# Altium project ESD_Project.PrjPcb
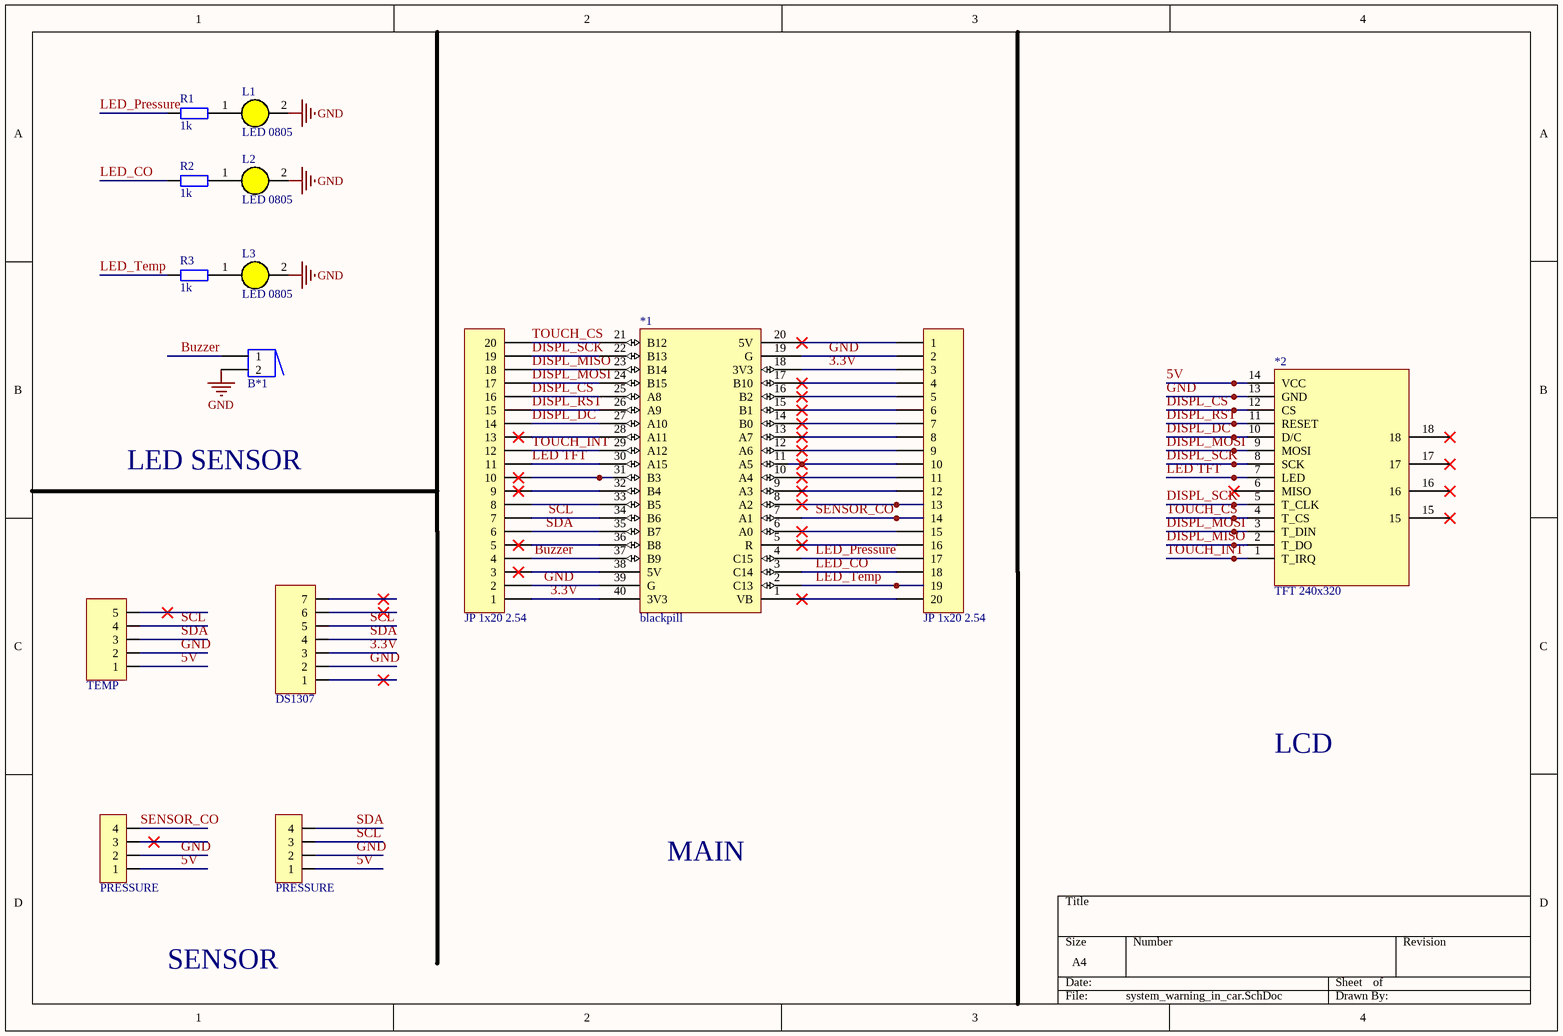
[diagram p0: system_warning_in_car.SchDoc]
3 sheets, 38 parts. Net scope: global (net labels, ports and power ports of the same name join across sheets).
Board file: system_warning_in_car.PcbDoc
Sheets:
  system_warning_in_car.SchDoc
  Power Diagram.SchDoc
  Power Suply.SchDoc

## Sheet system_warning_in_car.SchDoc
size A4; SheetNumber: 1; SheetTotal: 4

### Parts
*1  blackpill  [Blackpill]
*2  TFT 240x320  [TFT ILI]
B*1  (no value)  [BUZZER SMD]
JP1  JP 1x20 2.54  [JP 1x20 CT]
JP2  JP 1x20 2.54  [JP 1x20 CT]
JP3  DS1307  [JP 1x7 CT]
JP4  TEMP  [JP 1x5 CT]
JP5  PRESSURE  [JP 1x4 CT]
JP6  PRESSURE  [JP 1x4 CT]
L1  LED 0805  [LED-0805-Yellow]
L2  LED 0805  [LED-0805-Yellow]
L3  LED 0805  [LED-0805-Yellow]
R1  1k  [tro smd 0805]
R2  1k  [tro smd 0805]
R3  1k  [tro smd 0805]

### Nets
3.3V: *1.18(3V3) *1.40(3V3) JP1.1 JP2.3 JP3.3
5V: *2.14(VCC) JP4.1 JP5.1 JP6.1
GND: *1.19(G) *1.39(G) *2.13(GND) B*1.2 JP1.2 JP2.2 JP3.2 JP4.2 JP5.2 JP6.2 L1.2(K) L2.2(K) L3.2(K)
Buzzer: *1.37(B9) B*1.1 JP1.4
DISPL_CS: *1.25(A8) *2.12(CS) JP1.16
DISPL_DC: *1.27(A10) *2.10(D/C) JP1.14
DISPL_MISO: *1.23(B14) *2.2(T_DO) JP1.18
DISPL_MOSI: *1.24(B15) *2.3(T_DIN) *2.9(MOSI) JP1.17
DISPL_RST: *1.26(A9) *2.11(RESET) JP1.15
DISPL_SCK: *1.22(B13) *2.5(T_CLK) *2.8(SCK) JP1.19
LED TFT: *1.30(A15) *2.7(LED) JP1.11
LED_CO: *1.3(C14) JP2.18 R2.2
LED_Pressure: *1.4(C15) JP2.17 R1.2
LED_Temp: *1.2(C13) JP2.19 R3.2
SCL: *1.34(B6) JP1.7 JP3.5 JP4.4 JP6.3
SDA: *1.35(B7) JP1.6 JP3.4 JP4.3 JP6.4
SENSOR_CO: *1.7(A1) JP2.14 JP5.4
TOUCH_CS: *1.21(B12) *2.4(T_CS) JP1.20
TOUCH_INT: *1.29(A12) *2.1(T_IRQ) JP1.12
Net*1_1: *1.1(VB) JP2.20
Net*1_5: *1.5(R) JP2.16
Net*1_6: *1.6(A0) JP2.15
Net*1_8: *1.8(A2) JP2.13
Net*1_9: *1.9(A3) JP2.12
Net*1_10: *1.10(A4) JP2.11
Net*1_11: *1.11(A5) JP2.10
Net*1_12: *1.12(A6) JP2.9
Net*1_13: *1.13(A7) JP2.8
Net*1_14: *1.14(B0) JP2.7
Net*1_15: *1.15(B1) JP2.6
Net*1_16: *1.16(B2) JP2.5
Net*1_17: *1.17(B10) JP2.4
Net*1_20: *1.20(5V) JP2.1
Net*1_28: *1.28(A11) JP1.13
Net*1_31: *1.31(B3) JP1.10
Net*1_32: *1.32(B4) JP1.9
Net*1_33: *1.33(B5) JP1.8
Net*1_36: *1.36(B8) JP1.5
Net*1_38: *1.38(5V) JP1.3
NetL1_1: L1.1(A) R1.1
NetL2_1: L2.1(A) R2.1
NetL3_1: L3.1(A) R3.1

Not connected (* = marked no-connect by the designer): *2 6(MISO)* 15* 16* 17* 18*; JP3 1* 6* 7*; JP4 5*; JP5 3*

### Notes on the sheet
- LED SENSOR
- LCD
- MAIN
- SENSOR

### Library data of the parts
B*1 = Buzzer
JP1 JP2 = JP 1x20 2.54 Cai Thang: Cắm; Ten_Linh_Kien: Jump Đơn Cái 2.54MM 1x20P Thẳng; Don_Vi: Con; Ma_Hang: MH004006; Ghi_Chu: *; Kieu_Chan: *; Chung_Loai: Cắm
JP3 = JP 1x7 2.54 Cai Thang: Cắm; Ten_Linh_Kien: Jump Đơn Cái 2.54MM 1x20P Thẳng; Don_Vi: Con; Ma_Hang: MH004006; Ghi_Chu: *; Kieu_Chan: *; Chung_Loai: Cắm
JP4 = JP 1x5 2.54 Cai Thang: Cắm; Ten_Linh_Kien: Jump Đơn Cái 2.54MM 1x20P Thẳng; Don_Vi: Con; Ma_Hang: MH004006; Ghi_Chu: *; Kieu_Chan: *; Chung_Loai: Cắm
JP5 JP6 = JP 1x4 2.54 Cai Thang: Cắm; Ten_Linh_Kien: Jump Đơn Cái 2.54MM 1x20P Thẳng; Don_Vi: Con; Ma_Hang: MH004006; Ghi_Chu: *; Kieu_Chan: *; Chung_Loai: Cắm
L1-L3 = LED 0805 Vang: Dán; Don_Vi: Con; Ma_Hang: MH002329; Ten_Linh_Kien: LED 0805 Màu Vàng ( Yellow); Ghi_Chu: *; Kieu_Chan: *; Chung_Loai: Dán
R1-R3 = Tro 0805 1% 1k: Dán; Don_Vi: Con; So_Chan: 2; Ten_Linh_Kien: Trở 0805 1% 1k; Ma_Hang: MH005468; Chung_Loai: Dán; Kieu_Chan: *

## Sheet Power Diagram.SchDoc
size A4; SheetNumber: 3; SheetTotal: 4
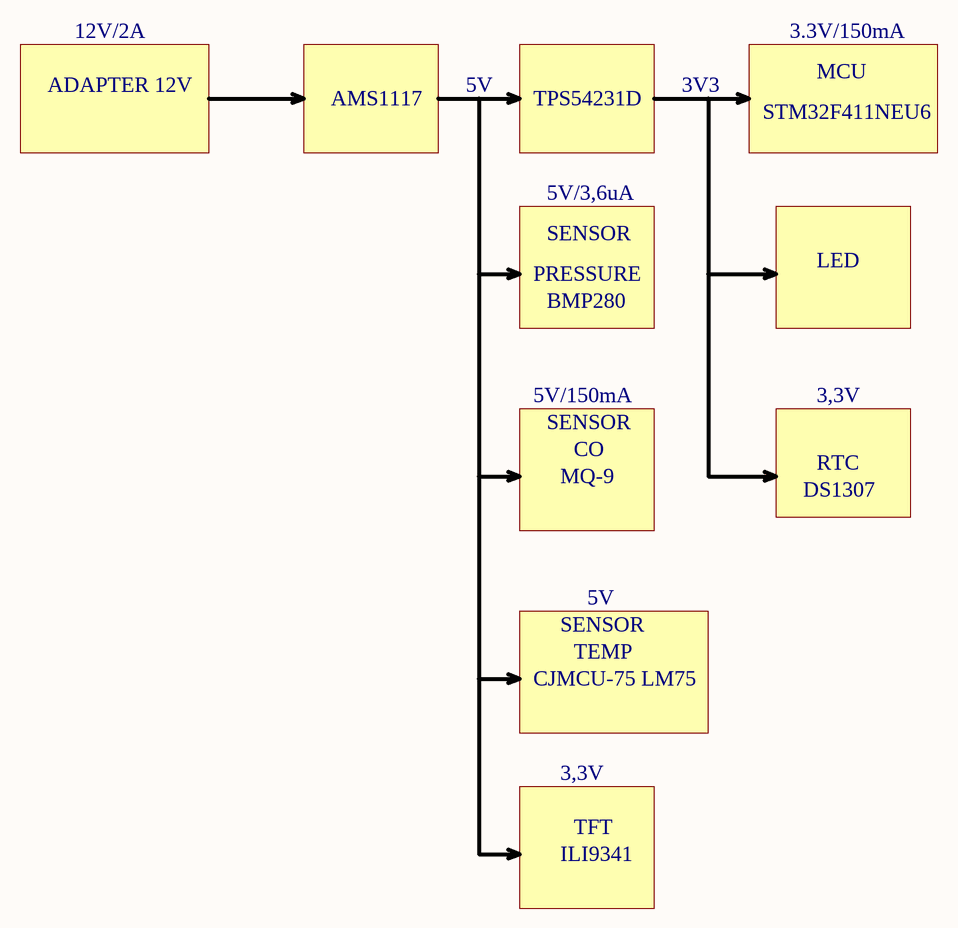
[diagram p1: Power Diagram.SchDoc]

### Notes on the sheet
- ADAPTER 12V
- 12V/2A
- 5V
- 3V3
- 3.3V/150mA
- MCU
- AMS1117
- TPS54231D
- STM32F411NEU6
- 5V/3,6uA
- PRESSURE
- SENSOR
- LED
- BMP280
- 5V/150mA
- 3,3V
- MQ-9
- CO
- DS1307
- RTC
- CJMCU-75 LM75
- TEMP
- TFT
- ILI9341

## Sheet Power Suply.SchDoc
size A4; SheetNumber: 4; SheetTotal: 4
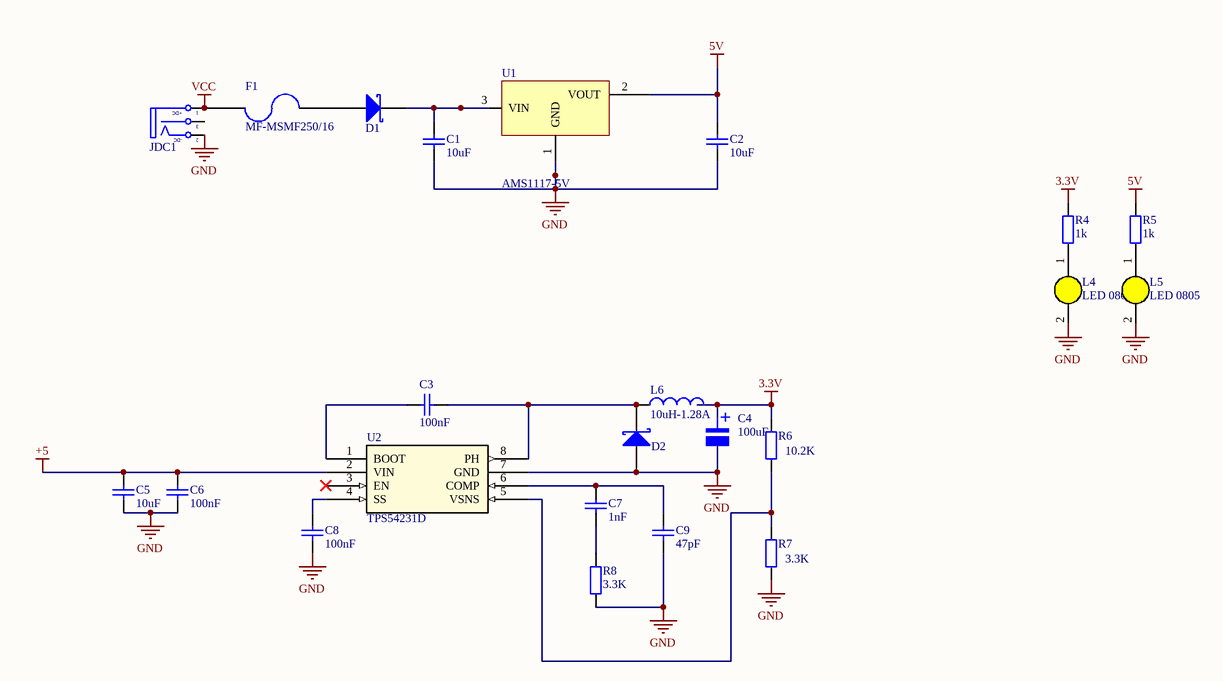
[diagram p2: Power Suply.SchDoc]

### Parts
C1  10uF  [tu 0805]
C2  10uF  [tu 0805]
C3  100nF  [tu 0805]
C4  100uF  [tu nhom 6.3 (d)]
C5  10uF  [tu 0805]
C6  100nF  [tu 0805]
C7  1nF  [tu 0805]
C8  100nF  [tu 0805]
C9  47pF  [tu 0805]
D1  D Schottky  [SS34]  (value not drawn)
D2  D Schottky  [SS34]  (value not drawn)
F1  MF-MSMF250/16  [MF-MSMF250/16]
JDC1  Jack DC  [DC-IN]  (value not drawn)
L4  LED 0805  [LED-0805-Yellow]
L5  LED 0805  [LED-0805-Yellow]
L6  value 10uH-1.28A  [I0805]  (hidden comment: Inductor)
R4  1k  [tro smd 0805]
R5  1k  [tro smd 0805]
R6  10.2K  [tro smd 0805]
R7  3.3K  [tro smd 0805]
R8  3.3K  [tro smd 0805]
U1  AMS1117-5V  [SOT230P700X180-4N]
U2  TPS54231D  [SOIC8_50_328_25X90_SMT]

### Nets
3.3V: C4.1 L6.2 R4.2 R6.2
5V: C2.1 R5.2 U1.2(VOUT)
+5: C5.2 C6.2 U2.2(VIN)
GND: C1.2 C2.2 C4.2 C5.1 C6.1 C8.1 C9.1 D2.1(A) JDC1.2(TN) L4.2(K) L5.2(K) R7.1 R8.1 U1.1(GND) U2.7(GND)
VCC: F1.1 JDC1.1(T)
NetC1_1: C1.1 D1.2(K) U1.3(VIN)
NetC3_1: C3.1 U2.1(BOOT)
NetC3_2: C3.2 D2.2(K) L6.1 U2.8(PH)
NetC7_1: C7.1 R8.2
NetC7_2: C7.2 C9.2 U2.6(COMP)
NetC8_2: C8.2 U2.4(SS)
NetD1_1: D1.1(A) F1.2
NetL4_1: L4.1(A) R4.1
NetL5_1: L5.1(A) R5.1
NetR6_1: R6.1 R7.2 U2.5(VSNS)

Not connected (* = marked no-connect by the designer): JDC1 3(S); U2 3(EN)*

### Notes on the sheet
- (in symbol Jack DC) +DC; -DC
- (in symbol Tu Nhom 100uF 16V) +

### Library data of the parts
C1 C2 = Tu 0805 101 50V 20%: Dán; Don_Vi: Con; So_Chan: 2; Ten_Linh_Kien: Tụ 0805 101-0.1nF 50V 20%; Ma_Hang: MH002806; Chung_Loai: Dán; Kieu_Chan: *
C3 C5-C9 = Tu 0805 106 16V 10%: Dán; Ten_Linh_Kien: Tụ 0805 106-10uF 10% 16V; So_Chan: 2; Don_Vi: Con; Ma_Hang: MH004553; Chung_Loai: Dán; Kieu_Chan: *
C4 = Tu Nhom 100uF 16V: Dán; Don_Vi: Con; So_Chan: 2; Ten_Linh_Kien: Tụ Nhôm 100uF 16V 6.3x5.4MM; Ma_Hang: MH002219; Chung_Loai: Dán; Kieu_Chan: *
D1 D2 = D Schottky: Schottky Diode; Published: 8-Jun-2000; LatestRevisionDate: 17-Jul-2002; LatestRevisionNote: Re-released for DXP Platform.; PackageReference: SMB; Publisher: Altium Limited; PackageDescription: DO-214-AA/SMB; 2 C-Bend Leads; Body 5.3 x 3.6 mm, inc. leads (LxW); Code_JEDEC: DO-214-AA
JDC1 = Jack DC: Jack DC input; Value: Jac DC
L4 L5 = LED 0805 Vang: as L1 on sheet system_warning_in_car; Ghi_Chu: *; Kieu_Chan: *; Chung_Loai: Dán
R4 R5 = Tro 0805 1% 1k: as R1 on sheet system_warning_in_car; Chung_Loai: Dán; Kieu_Chan: *
R6-R8 = Tro 0805 1% 5.1k: Dán; Don_Vi: Con; So_Chan: 2; Ten_Linh_Kien: Trở 0805 1% 5.1k; Ma_Hang: MH008812; Chung_Loai: Dán; Kieu_Chan: *
U2 = IC_TPS54360DDAR: Buck, Split Rail Switching Regulator IC Positive Adjustable 0.8V 1 Output 3.5A 8-PowerSOIC (0.154", 3.90mm Width); Manufacturer: Texas Instruments; Alternate Part Number-1: NA; Manufacturer Part Number: TPS54360DDAR; Case/Package: SOIC8; Supplier-1: LCSC; Supplier Part Number-1: C44377

## Nets that join several sheets
3.3V: system_warning_in_car (5 pins), Power Suply (C4.1 L6.2 R4.2 R6.2)
5V: system_warning_in_car (*2.14 JP4.1 JP5.1 JP6.1), Power Suply (C2.1 R5.2 U1.2)
GND: system_warning_in_car (13 pins), Power Suply (15 pins)